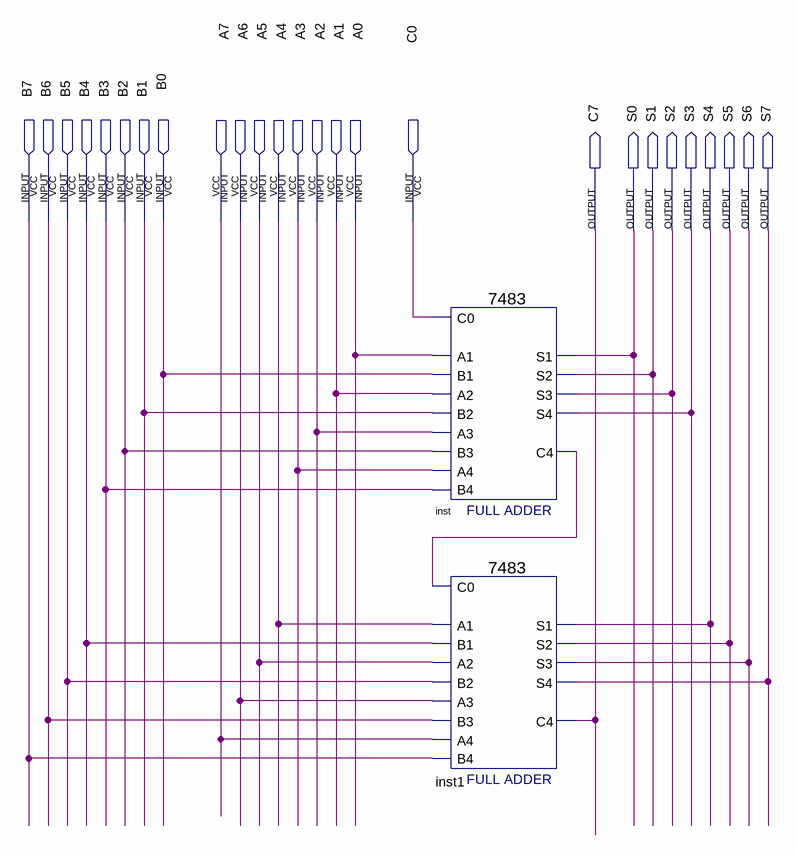
[diagram p0: schematic sheet]
// Quartus schematic adder8b.bdf as structural Verilog: 2 symbols, 26 pins
module adder8b (
  input  B7,
  input  B6,
  input  B5,
  input  B4,
  input  B3,
  input  B2,
  input  B1,
  input  B0,
  input  A7,
  input  A6,
  input  A5,
  input  A4,
  input  A3,
  input  A2,
  input  A1,
  input  A0,
  input  C0,
  output C7,
  output S0,
  output S1,
  output S2,
  output S3,
  output S4,
  output S5,
  output S6,
  output S7
);

  wire inst_c4;

  \7483  inst (
    .B4(B3), .C0(C0), .A1(A0), .A2(A1), .B1(B0), .B2(B1), .A3(A2), .B3(B2), .A4(A3), .S3(S2), .S4(S3),
    .S2(S1), .C4(inst_c4), .S1(S0));
  \7483  inst1 (
    .B4(B7), .C0(inst_c4), .A1(A4), .A2(A5), .B1(B4), .B2(B5), .A3(A6), .B3(B6), .A4(A7), .S3(S6), .S4(S7),
    .S2(S5), .C4(C7), .S1(S4));
endmodule
